# EAGLE design Potencia (EAGLE 7.4.0)
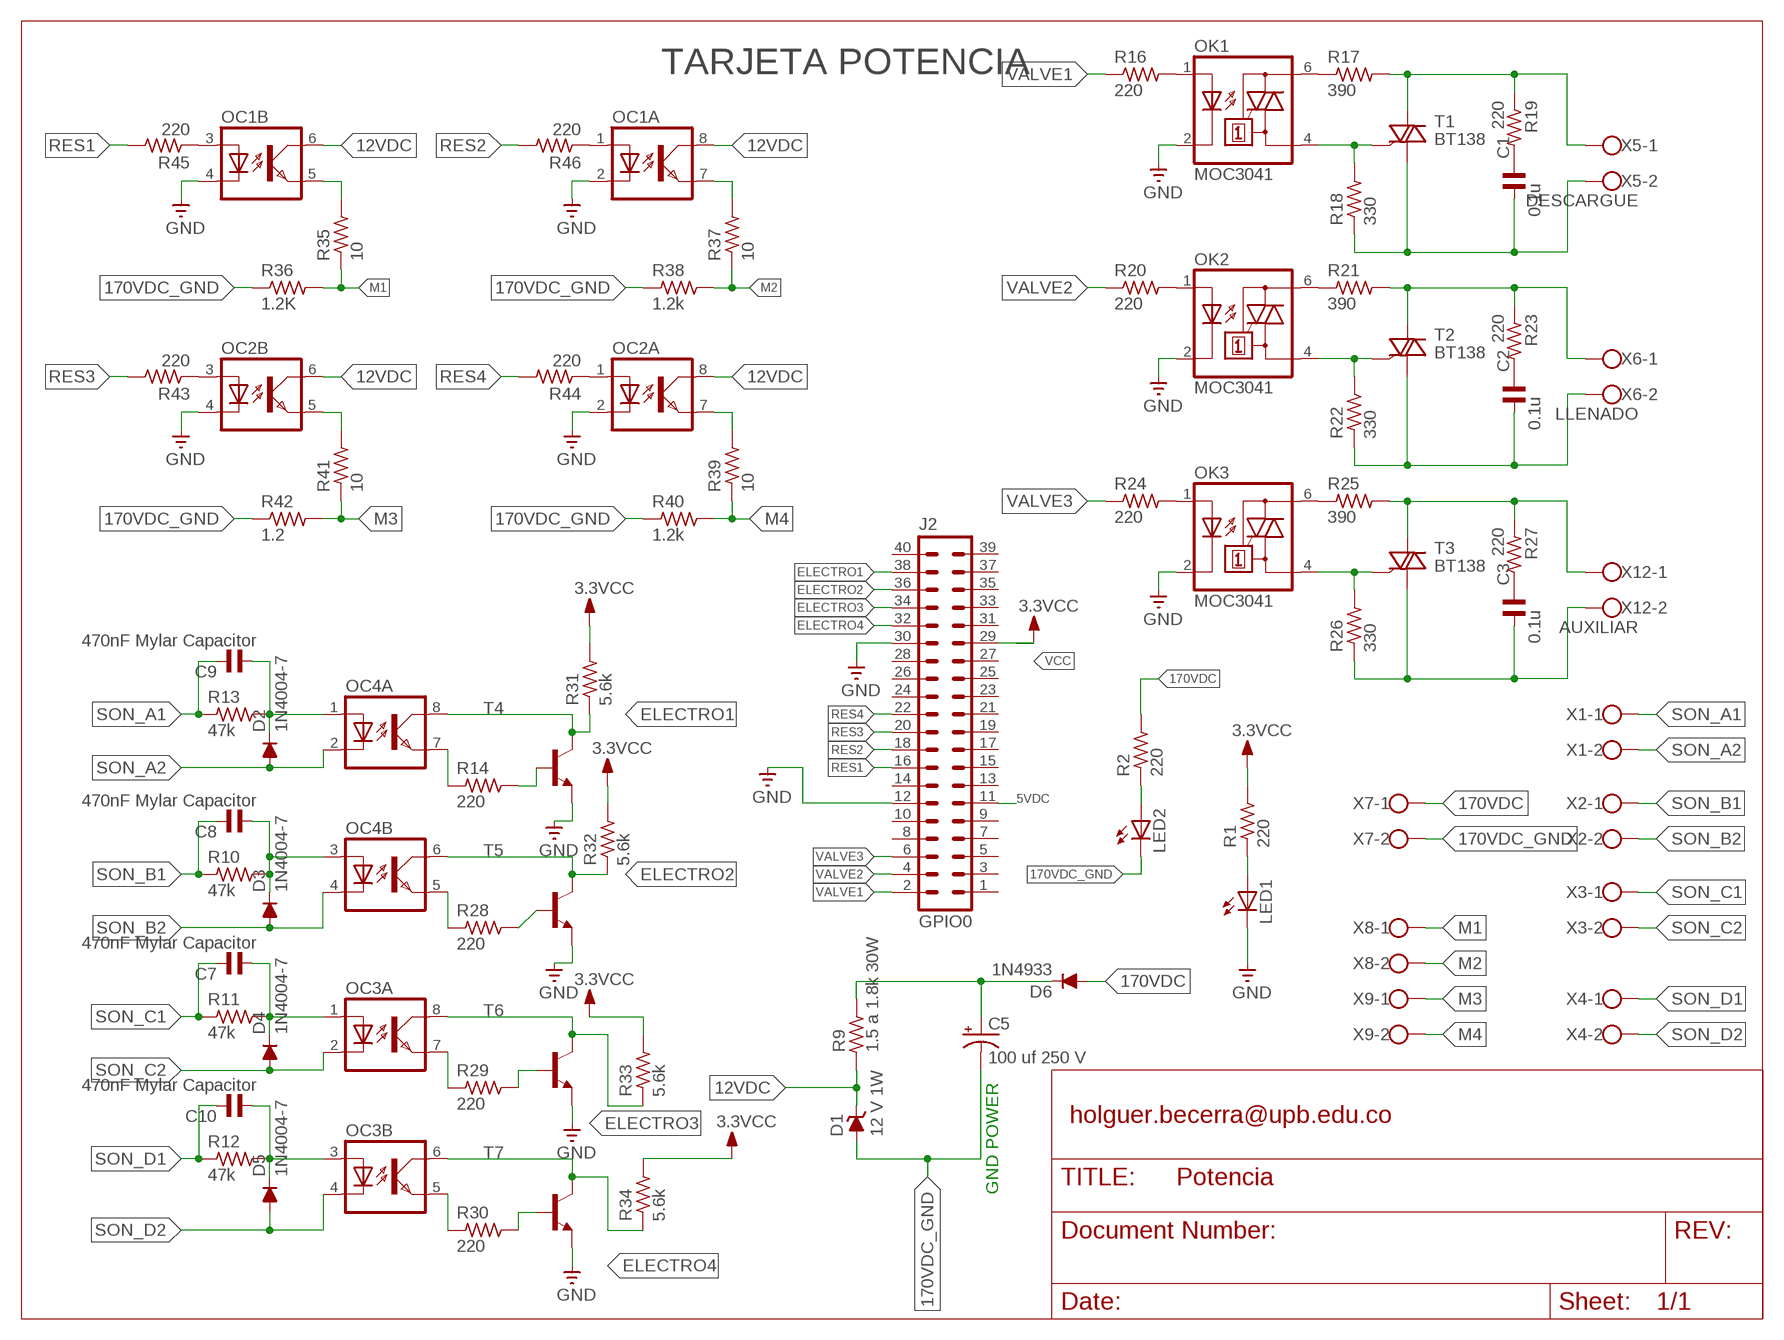
[diagram p0: schematic, sheet 1]

## Parts
C1  0.1u  C-US075-042X103  [C075-042X103]
C2  0.1u  C-US075-042X103  [C075-042X103]
C3  0.1u  C-US075-042X103  [C075-042X103]
C5  100 uf 250 V  CPOL-USE10-20  [EB20D]
C7  470nF Mylar Capacitor  C7.5/3  [C7.5B3]
C8  470nF Mylar Capacitor  C7.5/3  [C7.5B3]
C9  470nF Mylar Capacitor  C7.5/3  [C7.5B3]
C10  470nF Mylar Capacitor  C7.5/3  [C7.5B3]
D1  12 V 1W  ZENER-DIODEC1702-15  [C1702-15]
D2  1N4004-7  [DO41-7]
D3  1N4004-7  [DO41-7]
D4  1N4004-7  [DO41-7]
D5  1N4004-7  [DO41-7]
D6  1N4933  [DO41-10]
J2  GPIO0  ML40  [ML40]
LED1  LED3MM  [LED3MM]
LED2  LED3MM  [LED3MM]
OC1  ILD621  [DIL08]
OC2  ILD621  [DIL08]
OC3  ILD621  [DIL08]
OC4  ILD621  [DIL08]
OK1  MOC3041  MOC3041M  [DIL06]
OK2  MOC3041  MOC3041M  [DIL06]
OK3  MOC3041  MOC3041M  [DIL06]
R1  220  R-US_0207/10  [0207/10]
R2  220  R-US_0207/7  [0207/7]
R9  1.5 a 1.8k 30W  RCR15  [CR15]
R10  47k  R-US_0207/7  [0207/7]
R11  47k  R-US_0207/7  [0207/7]
R12  47k  R-US_0207/7  [0207/7]
R13  47k  R-US_0207/7  [0207/7]
R14  220  R-US_0207/7  [0207/7]
R16  220  R-US_0207/7  [0207/7]
R17  390  R-US_0207/2V  [0207/2V]
R18  330  R-US_0207/7  [0207/7]
R19  220  R-US_0309/V  [0309V]
R20  220  R-US_0207/7  [0207/7]
R21  390  R-US_0207/2V  [0207/2V]
R22  330  R-US_0207/7  [0207/7]
R23  220  R-US_0309/V  [0309V]
R24  220  R-US_0207/7  [0207/7]
R25  390  R-US_0207/2V  [0207/2V]
R26  330  R-US_0207/7  [0207/7]
R27  220  R-US_0309/V  [0309V]
R28  220  R-US_0207/7  [0207/7]
R29  220  R-US_0207/7  [0207/7]
R30  220  R-US_0207/7  [0207/7]
R31  5.6k  R-US_0207/7  [0207/7]
R32  5.6k  R-US_0207/7  [0207/7]
R33  5.6k  R-US_0207/7  [0207/7]
R34  5.6k  R-US_0207/7  [0207/7]
R35  10  R-US_0207/7  [0207/7]
R36  1.2K  R-US_0207/7  [0207/7]
R37  10  R-US_0207/7  [0207/7]
R38  1.2k  R-US_0207/7  [0207/7]
R39  10  R-US_0207/7  [0207/7]
R40  1.2k  R-US_0207/7  [0207/7]
R41  10  R-US_0207/7  [0207/7]
R42  1.2  R-US_0207/7  [0207/7]
R43  220  R-US_0207/7  [0207/7]
R44  220  R-US_0207/7  [0207/7]
R45  220  R-US_0207/7  [0207/7]
R46  220  R-US_0207/7  [0207/7]
T1  BT138  BT138-V  [TO220BV]
T2  BT138  BT138-V  [TO220BV]
T3  BT138  BT138-V  [TO220BV]
T4  2N2222-NPN-TO92-EBC  [TO92-EBC]
T5  2N2222-NPN-TO92-EBC  [TO92-EBC]
T6  2N2222-NPN-TO92-EBC  [TO92-EBC]
T7  2N2222-NPN-TO92-EBC  [TO92-EBC]
X1  CBE2  [BE2]
X2  CBE2  [BE2]
X3  CBE2  [BE2]
X4  CBE2  [BE2]
X5  DESCARGUE  CBE2  [BE2]
X6  LLENADO  CBE2  [BE2]
X7  CBE2  [BE2]
X8  CBE2  [BE2]
X9  CBE2  [BE2]
X12  AUXILIAR  CBE2  [BE2]

## Nets
5VDC: J2.11
12VDC: D1.C OC1.6(B:COL) OC1.8(A:COL) OC2.6(B:COL) OC2.8(A:COL) R9.1
170VDC: D6.A R2.2 X7.1
170VDC_GND: C5.- D1.A LED2.K(C) R36.1 R38.1 R40.1 R42.1 X7.2
DAS: C5.+ D6.C R9.2
ELECTRO1: J2.38 OC4.8(A:COL) R31.1 T4.C
ELECTRO2: J2.36 OC4.6(B:COL) R32.1 T5.C
ELECTRO3: J2.34 OC3.8(A:COL) R33.1 T6.C
ELECTRO4: J2.32 OC3.6(B:COL) R34.1 T7.C
GND: J2.12 J2.30 LED1.K(C) OC1.2(A:C) OC1.4(B:C) OC2.2(A:C) OC2.4(B:C) OK1.2(C) OK2.2(C) OK3.2(C) T4.E T5.E T6.E T7.E
M1: R35.1 R36.2 X8.1
M2: R37.1 R38.2 X8.2
M3: R41.1 R42.2 X9.1
M4: R39.1 R40.2 X9.2
N$1: LED1.A R1.1
N$6: LED2.A R2.1
N$10: OK1.1(A) R16.2
N$12: OK2.1(A) R20.2
N$13: OK1.4(A1) R18.2 T1.G
N$14: OK1.6(A2) R17.1
N$15: R17.2 R19.1 T1.T2(A2) X5.1
N$16: C1.2 R18.1 T1.T1(A1) X5.2
N$17: C1.1 R19.2
N$18: OK2.4(A1) R22.2 T2.G
N$19: OK2.6(A2) R21.1
N$20: R21.2 R23.1 T2.T2(A2) X6.1
N$21: C2.2 R22.1 T2.T1(A1) X6.2
N$22: C2.1 R23.2
N$23: OK3.1(A) R24.2
N$24: OK3.4(A1) R26.2 T3.G
N$25: OK3.6(A2) R25.1
N$26: R25.2 R27.1 T3.T2(A2) X12.1
N$27: C3.2 R26.1 T3.T1(A1) X12.2
N$28: C3.1 R27.2
N$29: C9.1 D2.C OC4.1(A:A) R13.2
N$32: OC1.5(B:EMIT) R35.2
N$37: OC4.7(A:EMIT) R14.1
N$38: R14.2 T4.B
N$40: OC2.5(B:EMIT) R41.2
N$41: OC2.3(B:A) R43.1
N$44: OC4.5(B:EMIT) R28.1
N$45: R28.2 T5.B
N$46: OC3.7(A:EMIT) R29.1
N$47: R29.2 T6.B
N$48: OC3.5(B:EMIT) R30.1
N$49: R30.2 T7.B
N$50: OC1.3(B:A) R45.1
N$51: C8.1 D3.C OC4.3(B:A) R10.2
N$52: OC1.1(A:A) R46.1
N$54: C7.1 D4.C OC3.1(A:A) R11.2
N$55: OC2.1(A:A) R44.1
N$57: C10.1 D5.C OC3.3(B:A) R12.2
N$59: OC2.7(A:EMIT) R39.2
N$68: OC1.7(A:EMIT) R37.2
RES1: J2.16 R45.2
RES2: J2.18 R46.2
RES3: J2.20 R43.2
RES4: J2.22 R44.2
SON_A1: C9.2 R13.1 X1.1
SON_A2: D2.A OC4.2(A:C) X1.2
SON_B1: C8.2 R10.1 X2.1
SON_B2: D3.A OC4.4(B:C) X2.2
SON_C1: C7.2 R11.1 X3.1
SON_C2: D4.A OC3.2(A:C) X3.2
SON_D1: C10.2 R12.1 X4.1
SON_D2: D5.A OC3.4(B:C) X4.2
VALVE1: J2.2 R16.1
VALVE2: J2.4 R20.1
VALVE3: J2.6 R24.1
VCC: J2.29 R1.2 R31.2 R32.2 R33.2 R34.2 ; supply symbol labelled 3.3VCC
Unconnected: J2.1 J2.3 J2.5 J2.7 J2.8 J2.9 J2.10 J2.13 J2.14 J2.15 J2.17 J2.19 J2.21 J2.23 J2.24 J2.25 J2.26 J2.27 J2.28 J2.31 J2.33 J2.35 J2.37 J2.39 J2.40

## Notes on the sheet
- TARJETA POTENCIA
- holguer.becerra@upb.edu.co
- GND POWER

## Library data of the parts
C1-C3 = rcl:C-US: CAPACITOR, American symbol
C5 = rcl:CPOL-US: POLARIZED CAPACITOR, American symbol
C7-C10 = capacitor-wima:C: CAPACITOR naming: grid - package width
D1 = diode:ZENER-DIODE: Z-Diode
D2-D5 = diode:1N4004: DIODE general purpose rectifier, 1 A
D6 = diode:1N4933: DIODE fast recovery rectifier, 1A
J2 = con-harting-ml:ML40: HARTING
LED1 LED2 = adafruit:LED: LED OSRAM: - CHIPLED LG R971, LG N971, LY N971, LG Q971, LY Q971, LO R971, LY R971 LH N974, LH R974 LS Q976, LO Q976, LY Q976 LO Q996 - Hyper CHIPLED LW Q18S LB Q993, LB Q99A, LB R99A - SideLED LS A670, LO A670, LY A670, LG A670, LP A670 LB A673, LV A673, LT A673, LW A673 LH A674 LY A675 LS A676, LA A676, LO A676, LY A676, LW A676 LS A679, LY A679, LG A679 - Hyper Micro SIDELED® LS Y876, LA Y876, LO Y876, LY Y876 LT Y87S - SmartLED LW L88C, LW L88S LB L89C, LB L89S, LG L890 LS L89K, LO L89K, LY L89K LS L896, LA L896, LO L896, LY L896 - TOPLED LS T670, LO T670, LY T670, LG T670, LP T670 LSG T670, LSP T670, LSY T670, LOP T670, LYG T670 LG T671, LOG T671, LSG T671 LB T673, LV T673, LT T673, LW T673 LH T674 LS T676, LA T676, LO T676, LY T676, LB T676, LH T676, LSB T676, LW T676 LB T67C, LV T67C, LT T67C, LS T67K, LO T67K, LY T67K, LW E67C LS E67B, LA E67B, LO E67B, LY E67B, LB E67C, LV E67C, LT E67C LW T67C LS T679, LY T679, LG T679 LS T770, LO T770, LY T770, LG T770, LP T770 LB T773, LV T773, LT T773, LW T773 LH T774 LS E675, LA E675, LY E675, LS T675 LS T776, LA T776, LO T776, LY T776, LB T776 LHGB T686 LT T68C, LB T68C - Hyper Mini TOPLED® LB M676 - Mini TOPLED Santana® LG M470 LS M47K, LO M47K, LY M47K Source: http://www.osram.convergy.de/
OC1-OC4 = optocoupler:ILD621: SIEMENS OPTO COUPLER
OK1-OK3 = optocoupler:MOC30*: 6-Pin DIP Zero-Cross Optoisolators Triac Driver Output (250/400 Volt Peak) Source: Data sheet <http://www.fairchildsemi.com/ds/MO/MOC3031M.pdf> The old path of data sheet not more available 2013-05-06.; MF: FAIRCHILD SEMICONDUCTOR; MPN: MOC3041M; OC_FARNELL: 1086677; OC_NEWARK: 78K6090
R1 R2 R10-R14 R16-R46 = rcl:R-US_: RESISTOR, American symbol
R9 = resistor-power:R: Power Resitor
T1-T3 = triac:BT138: TRIAC Source: http://www.semiconductors.philips.com BT138_SERIES_2.pdf
T4-T7 = transistor-neu-to92:*-NPN-: NPN Transistror
X1-X9 X12 = Bornera_tornillo_enchufable:CBE2

## Board
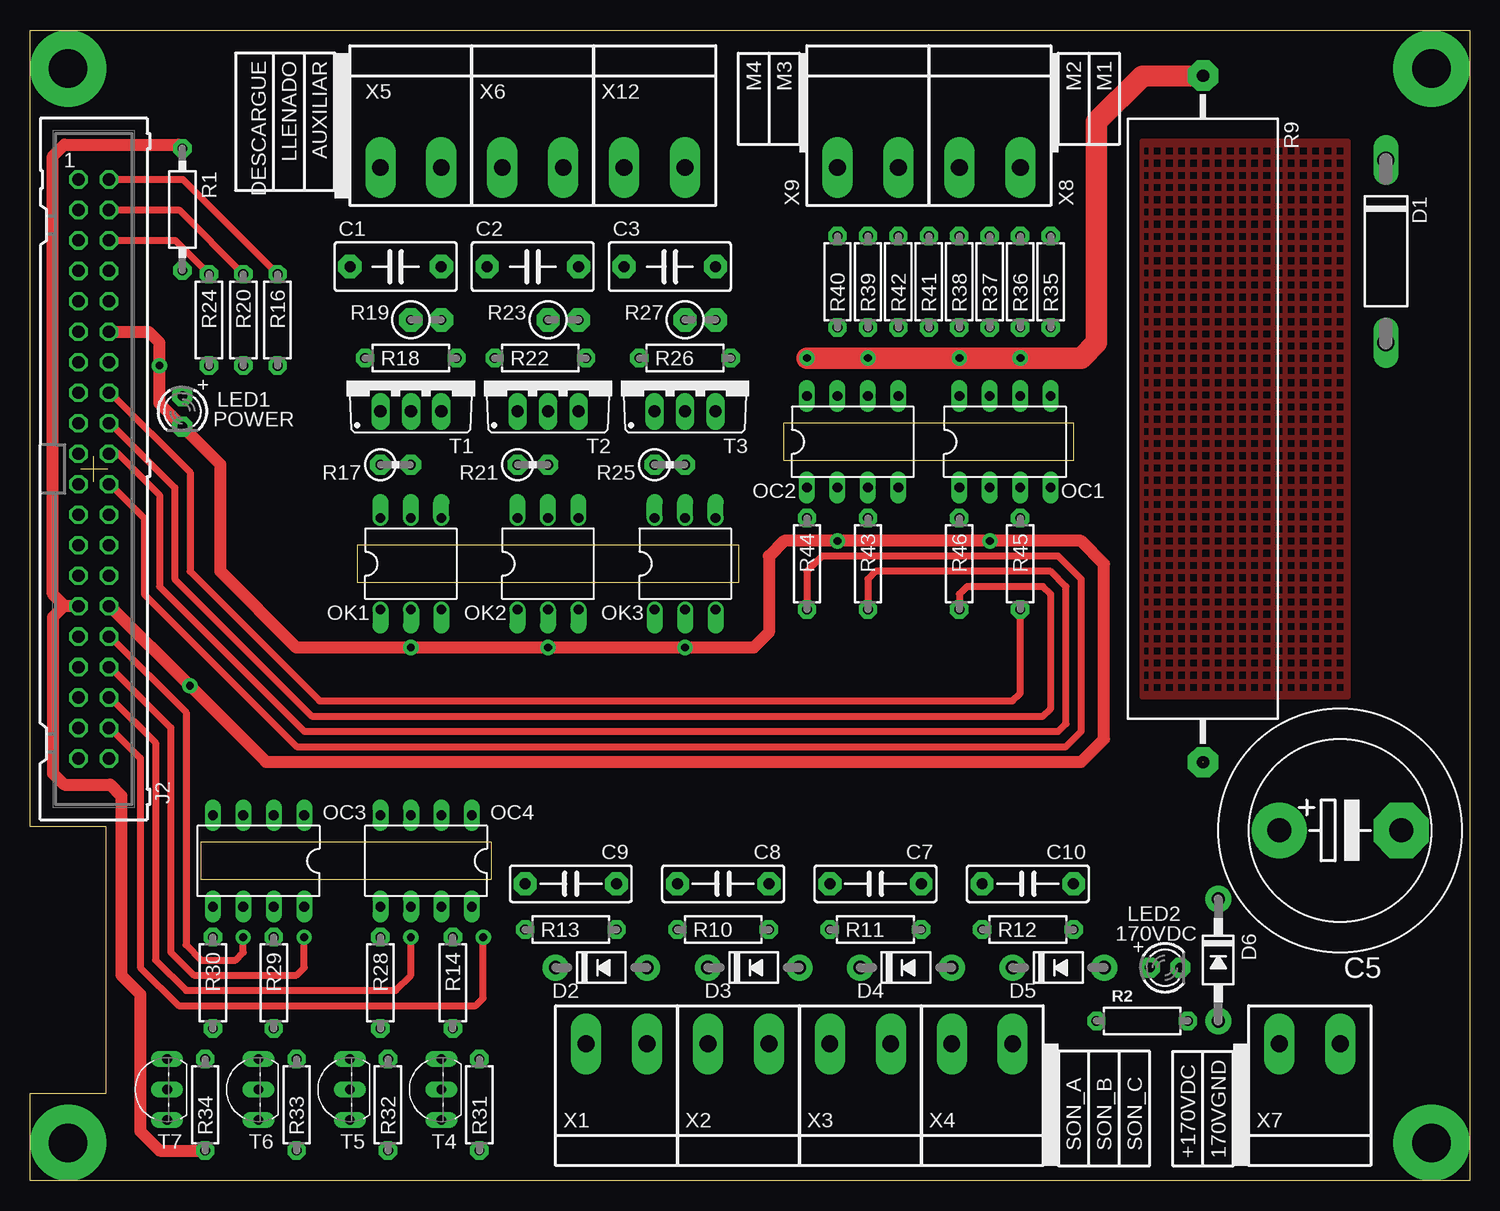
[diagram p1: board, top side]
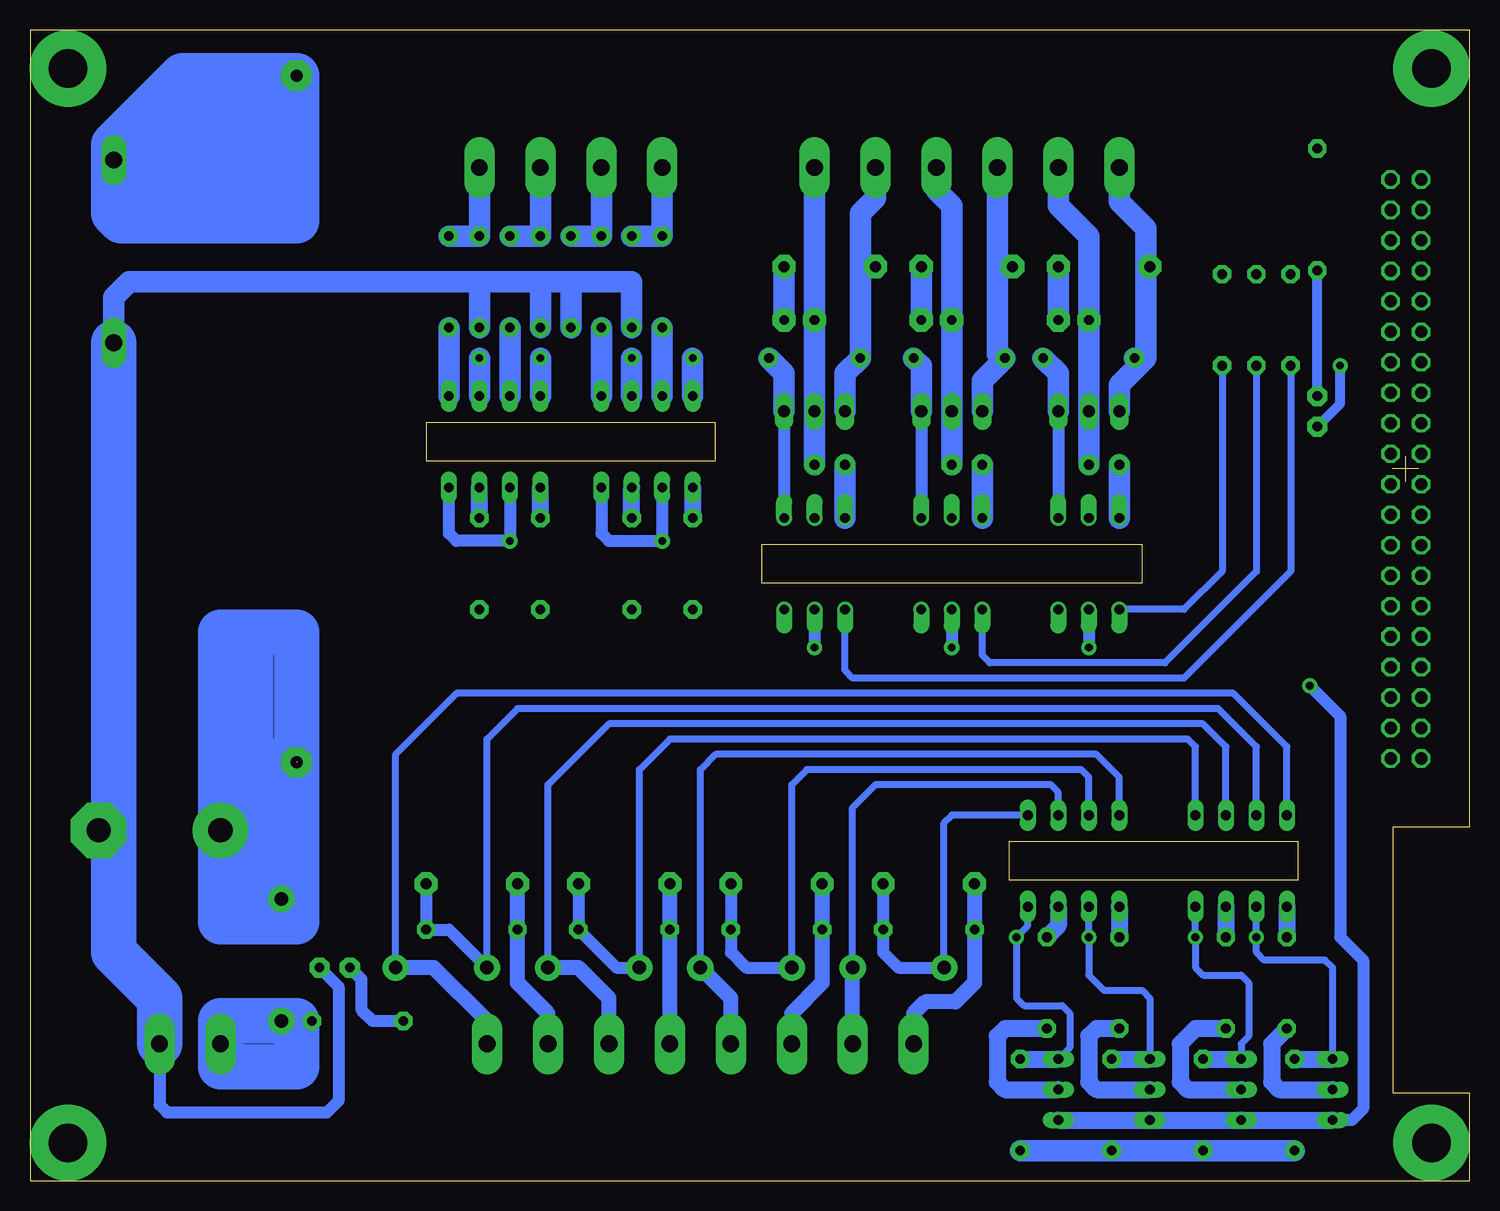
[diagram p2: board, bottom side, seen from below]

Size 120.02 x 95.89 mm. Coordinates in mm from the lower left corner, seen from the top.
Outline: 4.25,59.33 6.47,59.33
Outline: 5.32,58.26 5.32,60.4
Outline: 120.02,0 0,0 0,7.3 6.35,7.3 6.35,29.53 0,29.53 0,95.89 120.02,95.89 120.02,0
Outline: 27.3,53.02 59.05,53.02 59.05,49.85 27.3,49.85 27.3,53.02
Outline: 62.87,63.18 87,63.18 87,60.01 62.87,60.01 62.87,63.18
Outline: 14.29,28.26 38.42,28.26 38.42,25.08 14.29,25.08 14.29,28.26
Copper layers (1*16): Top 0.035mm / dielectric 1.5mm / Bottom 0.035mm
Design rules "default *": minimum track width 10mil, minimum drill 24mil, track to track 8mil, track to pad 8mil, pad to pad 8mil, via to via 8mil, smd to smd 8mil, copper to edge 1mil, drill to drill 8mil, minimum pad ring 10mil, minimum via ring 8mil, stop-mask expansion 4mil, vias tented up to drill 0mil, thermal gap 10mil

### Footprints (pad centres in the part's own frame; a part is rotated, then mirrored left to right if it is on the bottom)
C075-042X103 = drill 0.914 pad 1.93 octagon: 1 -3.81,0; 2 3.81,0
EB20D = drill 2.007 pad 4.597: + -5.08,0 | drill 2.007 pad 4.597 octagon: - 5.08,0
C7.5B3 = drill 0.914 pad 1.905 octagon: 1 -3.81,0; 2 3.81,0
C1702-15 = drill 1.397 long: A 7.62,0; C -7.62,0
DO41-7 = drill 1.118 pad 2.184: A 3.81,0; C -3.81,0
DO41-10 = drill 1.118 pad 2.184: A 5.08,0; C -5.08,0
ML40 = drill 1.016 octagon: 1 -24.13,-1.27; 2 -24.13,1.27; 3 -21.59,-1.27; 4 -21.59,1.27; 5 -19.05,-1.27; 6 -19.05,1.27; 7 -16.51,-1.27; 8 -16.51,1.27; 9 -13.97,-1.27; 10 -13.97,1.27; 11 -11.43,-1.27; 12 -11.43,1.27; 13 -8.89,-1.27; 14 -8.89,1.27; 15 -6.35,-1.27; 16 -6.35,1.27; 17 -3.81,-1.27; 18 -3.81,1.27; 19 -1.27,-1.27; 20 -1.27,1.27; 21 1.27,-1.27; 22 1.27,1.27; 23 3.81,-1.27; 24 3.81,1.27; 25 6.35,-1.27; 26 6.35,1.27; 27 8.89,-1.27; 28 8.89,1.27; 29 11.43,-1.27; 30 11.43,1.27; 31 13.97,-1.27; 32 13.97,1.27; 33 16.51,-1.27; 34 16.51,1.27; 35 19.05,-1.27; 36 19.05,1.27; 37 21.59,-1.27; 38 21.59,1.27; 39 24.13,-1.27; 40 24.13,1.27
LED3MM = drill 0.813 pad 1.676 octagon: A -1.27,0; K 1.27,0
DIL08 = drill 0.813 long: 1 -3.81,-3.81; 2 -1.27,-3.81; 3 1.27,-3.81; 4 3.81,-3.81; 5 3.81,3.81; 6 1.27,3.81; 7 -1.27,3.81; 8 -3.81,3.81
DIL06 = drill 0.813 offset: 1 -2.54,-3.81; 2 0,-3.81; 3 2.54,-3.81; 4 2.54,3.81; 5 0,3.81; 6 -2.54,3.81
0207/10 = drill 0.813 pad 1.524 octagon: 1 -5.08,0; 2 5.08,0
0207/7 = drill 0.813 pad 1.524 octagon: 1 -3.81,0; 2 3.81,0
CR15 = drill 1.016 pad 2.54 octagon: 1 -28.605,0; 2 28.605,0
0207/2V = drill 0.813 pad 1.676 octagon: 1 -1.27,0; 2 1.27,0
0309V = drill 0.813 pad 1.93 octagon: 1 -1.27,0; 2 1.27,0
TO220BV = drill 1.016 long: G 2.54,-2.54; T1 -2.54,-2.54; T2 0,-2.54
TO92-EBC = drill 0.813 long: B 0,-1.27; C 2.54,-1.27; E -2.54,-1.27
BE2 = drill 1.4 pad 2.54 long: 1 -2.54,0; 2 2.54,0

### Placement (x,y rotation side)
C1  30.48,76.2 180 top
C2  41.91,76.2 180 top
C3  53.34,76.2 180 top
C5  109.22,29.21 0 top
C7  70.48,24.77 180 top
C8  57.78,24.77 180 top
C9  45.09,24.77 180 top
C10  83.19,24.77 180 top
D1  113.03,77.47 270 top
D2  47.62,17.78 0 top
D3  60.33,17.78 0 top
D4  73.03,17.78 0 top
D5  85.72,17.78 0 top
D6  99.06,18.41 270 top
J2  5.32,59.33 270 top
LED1  12.7,64.14 270 top
LED2  94.61,17.78 0 top
OC1  81.28,61.59 0 top
OC2  68.58,61.59 0 top
OC3  19.05,26.67 180 top
OC4  33.02,26.67 180 top
OK1  31.75,51.44 0 top
OK2  43.18,51.44 0 top
OK3  54.61,51.44 0 top
R1  12.7,80.96 90 top
R2  92.71,13.34 0 top
R9  97.79,63.5 270 top
R10  57.78,20.95 0 top
R11  70.48,20.95 0 top
R12  83.19,20.95 0 top
R13  45.09,20.95 0 top
R14  35.24,16.51 270 top
R16  20.64,71.75 270 top
R17  30.48,59.69 0 top
R18  31.75,68.58 0 top
R19  33.02,71.75 0 top
R20  17.78,71.75 270 top
R21  41.91,59.69 0 top
R22  42.55,68.58 0 top
R23  44.45,71.75 0 top
R24  14.92,71.75 270 top
R25  53.34,59.69 0 top
R26  54.61,68.58 0 top
R27  55.88,71.75 0 top
R28  29.21,16.51 270 top
R29  20.32,16.51 270 top
R30  15.24,16.51 270 top
R31  37.47,6.35 270 top
R32  29.84,6.35 270 top
R33  22.23,6.35 270 top
R34  14.61,6.35 270 top
R35  85.09,74.93 270 top
R36  82.55,74.93 90 top
R37  80.01,74.93 270 top
R38  77.47,74.93 90 top
R39  67.31,74.93 270 top
R40  69.85,74.93 90 top
R41  72.39,74.93 270 top
R42  74.93,74.93 90 top
R43  69.85,51.44 270 top
R44  64.77,51.44 270 top
R45  82.55,51.44 270 top
R46  77.47,51.44 270 top
T1  31.75,66.67 0 top
T2  43.18,66.67 0 top
T3  54.61,66.67 0 top
T4  33.02,7.62 90 top
T5  25.4,7.62 90 top
T6  17.78,7.62 90 top
T7  10.16,7.62 90 top
X1  48.9,11.43 0 top
X2  59.05,11.43 0 top
X3  69.22,11.43 0 top
X4  79.38,11.43 0 top
X5  31.75,84.45 180 top
X6  41.91,84.45 180 top
X7  106.68,11.43 0 top
X8  80.01,84.45 180 top
X9  69.85,84.45 180 top
X12  52.07,84.45 180 top

### Tracks (layer width: path | path; a pad name or v marks a point on that pad's centre or on a via)
12VDC  (via drill 0.65 pad 1.27)
  Top 1.778: v64.77,68.58 v69.85,68.58 v77.47,68.58 v82.55,68.58 87.63,68.58 88.9,69.85 88.9,88.27 92.71,92.08 R9.1 97.82,92.08
  Bottom 1.778: OC2.8 v64.77,68.58 | OC2.6 v69.85,68.58 | OC1.8 v77.47,68.58 | OC1.6 v82.55,68.58
  Bottom 3.81: R9.1 107.28,92.11 113.03,86.36 D1.C 113.03,80.64 112.39,80.01 97.79,80.01 97.79,88.9 | 97.79,88.9 97.79,92.08 | 97.79,88.9 105.41,88.9 109.86,84.45 109.86,83.19 100.33,83.19 100.33,85.72 105.41,85.72
170VDC
  Bottom 1.016: R2.2 D6.A
  Bottom 3.81: X7.1 104.14,13.34 D6.A 97.79,13.34 97.79,9.53 104.14,9.53 X7.1
170VDC_GND
  Bottom 1.016: X7.2 109.22,6.35 108.58,5.71 95.25,5.71 94.3,6.67 94.3,16.19 LED2.K
  Bottom 1.778: R36.1 82.55,74.93 | 82.55,74.93 77.47,74.93 | 77.47,74.93 74.93,74.93 | 74.93,74.93 69.85,74.93 R40.1 | R42.1 74.93,74.93 | R38.1 77.47,74.93 | 82.55,74.93 111.76,74.93 113.03,73.66 D1.A
  Bottom 3.81: D1.A 113.03,29.21 | 113.03,29.21 113.03,19.05 109.22,15.24 X7.2 | C5.- 113.03,29.21
DAS  (1 unrouted)
  Bottom 3.81: 100.97,29.21 99.06,29.21 D6.C 99.06,21.59 | 99.06,21.59 97.79,21.59 97.79,34.92 101.6,34.92 | 99.06,21.59 101.6,21.59 | 101.6,21.59 104.14,21.59 C5.+ | 101.6,29.21 101.6,21.59 | 104.14,34.92 C5.+ | C5.+ 101.6,29.21 | 101.6,29.21 100.97,29.21 | 100.97,29.21 100.97,33.66 | 101.6,45.72 104.14,45.72 104.14,34.92 | 104.14,34.92 101.6,34.92 | 101.6,34.92 101.6,45.72 | 101.6,45.72 97.79,45.72 97.79,35.24
ELECTRO1  (via drill 0.65 pad 1.27)
  Top 0.6: J2.38 6.71,37.74 9.21,35.24 9.21,17.78 12.38,14.61 37.15,14.61 37.78,15.24 v37.78,20.32
  Bottom 0.6: OC4.8 36.83,21.27 v37.78,20.32 37.78,15.24 37.15,14.61 33.97,14.61 33.34,13.97 33.34,11.11 T4.C
  Bottom 1.422: R31.1 T4.C
ELECTRO2  (via drill 0.65 pad 1.27)
  Top 0.6: J2.36 6.71,40.28 10.48,36.51 10.48,18.41 13.02,15.88 30.48,15.88 31.75,17.14 v31.75,20.32
  Bottom 0.6: OC4.6 v31.75,20.32 31.75,17.14 30.48,15.88 27.3,15.88 26.67,15.24 T5.C
  Bottom 1.422: R32.1 T5.C
ELECTRO3  (via drill 0.65 pad 1.27)
  Top 0.6: J2.34 6.71,42.82 11.75,37.78 11.75,19.05 13.65,17.14 22.23,17.14 22.86,17.78 v22.86,20.32
  Bottom 0.6: OC3.8 v22.86,20.32 22.86,17.78 22.23,17.14 19.05,17.14 18.41,16.51 18.41,12.06 19.05,11.43 T6.C
  Bottom 1.422: R33.1 T6.C 18.41,10.16
ELECTRO4  (via drill 0.65 pad 1.27)
  Top 0.6: J2.32 6.71,45.36 13.02,39.05 13.02,19.68 14.29,18.41 17.14,18.41 17.78,19.05 v17.78,20.32
  Bottom 0.6: OC3.6 v17.78,20.32 17.78,19.05 17.14,18.41 12.06,18.41 11.43,17.78 T7.C
  Bottom 1.422: R34.1 T7.C
GND  (via drill 0.61 pad 1.27, 0.65 pad 1.27)
  Top 1.016: J2.30 6.71,47.9 v13.34,41.27 19.68,34.92 87.63,34.92 89.53,36.83 89.53,51.44 87.63,53.34 v80.01,53.34 v67.31,53.34 62.87,53.34 61.59,52.07 61.59,45.72 60.33,44.45 v54.61,44.45 v43.18,44.45 v31.75,44.45 22.23,44.45 15.88,50.8 15.88,59.69 10.79,64.77 v10.79,67.94 10.79,69.85 9.88,70.76 J2.12
  Bottom 0.813: LED1.K 10.79,64.77 v10.79,67.94
  Bottom 1.016: T7.E 9.84,5.08 8.89,6.03 8.89,18.41 10.79,20.32 10.79,38.73 v13.34,41.27 | OC2.2 v67.31,53.34 71.75,53.34 72.39,53.98 OC2.4 | OC1.2 v80.01,53.34 84.45,53.34 85.09,53.98 OC1.4 | OK3.2 v54.61,44.45 | OK2.2 v43.18,44.45 | OK1.2 v31.75,44.45
  Bottom 1.422: T4.E T5.E T6.E T7.E
M1
  Bottom 1.778: X8.1 R36.2 R35.1
M2
  Bottom 1.778: X8.2 R38.2 R37.1
M3
  Bottom 1.778: X9.1 R41.1 R42.2
M4
  Bottom 1.778: X9.2 R39.1 R40.2
N$1
  Bottom 0.813: LED1.A R1.1
N$2  (via drill 3.2 pad 6.35)
  other vias: 3.17,92.71
N$3  (via drill 3.2 pad 6.35)
  other vias: 116.84,92.71
N$4  (via drill 3.2 pad 6.35)
  other vias: 116.84,3.17
N$5  (via drill 3.2 pad 6.35)
  other vias: 3.17,3.17
N$6
  Bottom 1.016: LED2.A 92.39,16.83 92.39,14.29 91.44,13.34 R2.1
N$7
  pour Top (hatched): 92.71,86.68 109.86,86.68 109.86,40.32 92.71,40.32
N$10
  Bottom 0.6: R16.2 20.64,50.8 23.81,47.62 OK1.1
N$12
  Bottom 0.6: R20.2 17.78,50.8 25.4,43.18 40.01,43.18 40.64,43.81 OK2.1
N$13
  Bottom 1.016: T1.G OK1.4
  Bottom 1.778: T1.G 34.29,67.31 R18.2
N$14
  Bottom 1.778: OK1.6 R17.1
N$15
  Bottom 1.778: X5.1 34.29,81.28 31.75,78.74 R19.1 T1.T2 R17.2
N$16
  Bottom 1.778: T1.T1 29.21,66.36 26.99,68.58 | 26.99,68.58 26.99,76.2 | 26.99,76.2 26.99,79.38 29.21,81.6 X5.2 | C1.2 26.99,76.2 | R18.1 26.99,68.58
N$17
  Bottom 1.778: C1.1 R19.2
N$18
  Bottom 1.016: T2.G OK2.4
  Bottom 1.778: T2.G 45.72,67.94 R22.2
N$19
  Bottom 1.778: OK2.6 R21.1
N$20
  Bottom 1.778: X6.1 44.45,82.55 43.18,81.28 R23.1 T2.T2 R21.2
N$21
  Bottom 1.778: T2.T1 40.64,66.67 R22.1 39.37,68.9 39.37,76.2 | 39.37,76.2 X6.2 | C2.2 39.37,76.2
N$22
  Bottom 1.778: R23.2 C2.1
N$23
  Bottom 0.6: R24.2 14.92,50.8 23.81,41.91 51.44,41.91 52.07,42.55 OK3.1
N$24
  Bottom 1.016: T3.G OK3.4
  Bottom 1.778: T3.G 57.15,67.31 R26.2
N$25
  Bottom 1.778: OK3.6 R25.1
N$26
  Bottom 1.778: X12.1 R27.1 T3.T2 R25.2
N$27
  Bottom 1.778: T3.T1 52.07,67.31 R26.1 50.8,76.52 | 50.8,76.52 50.8,80.64 49.53,81.92 X12.2 | C3.2 50.8,76.52
N$28
  Bottom 1.778: R27.2 C3.1
N$29
  Bottom 0.6: OC4.1 43.18,30.48 43.81,29.84 D2.C
  Bottom 1.016: C9.1 R13.2 48.9,19.05 47.62,17.78 D2.C
N$32
  Bottom 1.778: OC1.5 R35.2
N$37
  Bottom 1.422: OC4.7 34.29,21.27 R14.1
N$38
  Bottom 1.422: R14.2 38.73,12.7 39.37,12.06 39.37,8.26 38.73,7.62 T4.B
N$40
  Bottom 1.778: OC2.5 R41.2
N$41
  Bottom 1.422: R43.1 OC2.3
N$44
  Bottom 1.422: OC4.5 R28.1
N$45
  Bottom 1.422: R28.2 31.11,12.7 31.75,12.06 31.75,8.26 31.11,7.62 T5.B
N$46
  Bottom 1.422: OC3.7 R29.1
N$47
  Bottom 1.422: R29.2 22.86,12.7 24.13,11.43 24.13,8.26 23.5,7.62 T6.B
N$48
  Bottom 1.422: OC3.5 R30.1
N$49
  Bottom 1.422: R30.2 16.51,11.43 16.51,8.26 15.88,7.62 T7.B
N$50
  Bottom 1.422: R45.1 OC1.3
N$51
  Bottom 0.6: OC4.3 31.75,33.66 32.38,34.29 55.24,34.29 56.52,33.02 D3.C
  Bottom 1.016: C8.1 R10.2 61.59,19.05 60.33,17.78 D3.C
N$52
  Bottom 1.422: R46.1 OC1.1
N$54
  Bottom 0.6: OC3.1 22.86,36.2 23.5,36.83 66.67,36.83 69.22,34.29 D4.C
  Bottom 1.016: C7.1 R11.2 71.12,17.78 D4.C
N$55
  Bottom 1.422: OC2.1 R44.1
N$57
  Bottom 0.6: OC3.3 17.78,36.2 20.95,39.37 79.38,39.37 81.92,36.83 D5.C
  Bottom 1.016: C10.1 R12.2 85.09,20.95 D5.C
N$59
  Bottom 1.778: OC2.7 R39.2
N$68
  Bottom 1.778: OC1.7 R37.2
RES1
  Top 0.6: J2.16 6.71,65.68 13.34,59.05 13.34,50.8 24.13,40.01 81.92,40.01 82.55,40.64 R45.2
RES2
  Top 0.6: J2.18 6.71,63.14 12.06,57.78 12.06,50.16 23.5,38.73 84.45,38.73 85.09,39.37 85.09,48.9 84.45,49.53 78.11,49.53 77.47,48.9 R46.2
RES3
  Top 0.6: J2.20 7.34,60.6 10.79,57.15 10.79,49.53 22.86,37.47 85.72,37.47 86.36,38.1 86.36,49.53 85.09,50.8 70.48,50.8 69.85,50.16 R43.2
RES4
  Top 0.6: J2.22 6.71,58.06 9.53,55.24 9.53,48.9 22.23,36.2 86.36,36.2 87.63,37.47 87.63,50.16 85.72,52.07 66.04,52.07 64.77,50.8 R44.2
SON_A1
  Bottom 1.27: C9.2 R13.1 41.27,16.51 42.86,14.92 45.4,14.92 46.35,13.97 X1.1
SON_A2
  Bottom 0.6: OC4.2 34.29,32.38 34.92,33.02 49.53,33.02 51.44,31.11 D2.A
  Bottom 1.27: X1.2 D2.A
SON_B1
  Bottom 1.27: C8.2 R10.1 53.98,16.51 56.52,13.97 X2.1
SON_B2
  Bottom 0.6: OC4.4 29.21,33.66 31.11,35.56 62.87,35.56 64.14,34.29 D3.A
  Bottom 1.27: X2.2 61.59,15.24 D3.A
SON_C1
  Bottom 1.27: X3.1 R11.1 C7.2
SON_C2
  Bottom 0.6: OC3.2 20.32,36.2 22.23,38.1 71.75,38.1 76.83,33.02 D4.A
  Bottom 1.27: X3.2 71.75,15.24 74.3,17.78 D4.A
SON_D1
  Bottom 1.27: X4.1 76.83,13.97 79.38,16.51 R12.1 C10.2
SON_D2
  Bottom 0.6: OC3.4 15.24,36.2 19.68,40.64 84.45,40.64 89.53,35.56 D5.A
  Bottom 1.27: X4.2 81.92,13.34 86.36,17.78 D5.A
VALVE1
  Top 0.6: J2.2 12.74,83.46 R16.1
VALVE2
  Top 0.6: J2.4 12.42,80.92 R20.1
VALVE3
  Top 0.6: J2.6 12.11,78.38 R24.1
VCC
  Top 1.016: R34.2 10.79,2.54 9.21,4.13 9.21,15.56 7.62,17.14 7.62,32.07 6.67,33.02 2.86,33.02 1.91,33.97 1.91,46.99 2.82,47.9 J2.29 2.9,47.9 1.91,48.9 1.91,85.41 2.86,86.36 12.38,86.36 R1.2
  Bottom 1.778: R31.2 R32.2 R33.2 R34.2

### Text on the board
tPlace: DESCARGUE / LLENADO / AUXILIAR | M4 / M3 | M2 / M1 | 1 | POWER | 170VDC | SON_A / SON_B / SON_C | +170VDC / 170VGND